# EAGLE schematic test (EAGLE 8.1.1)
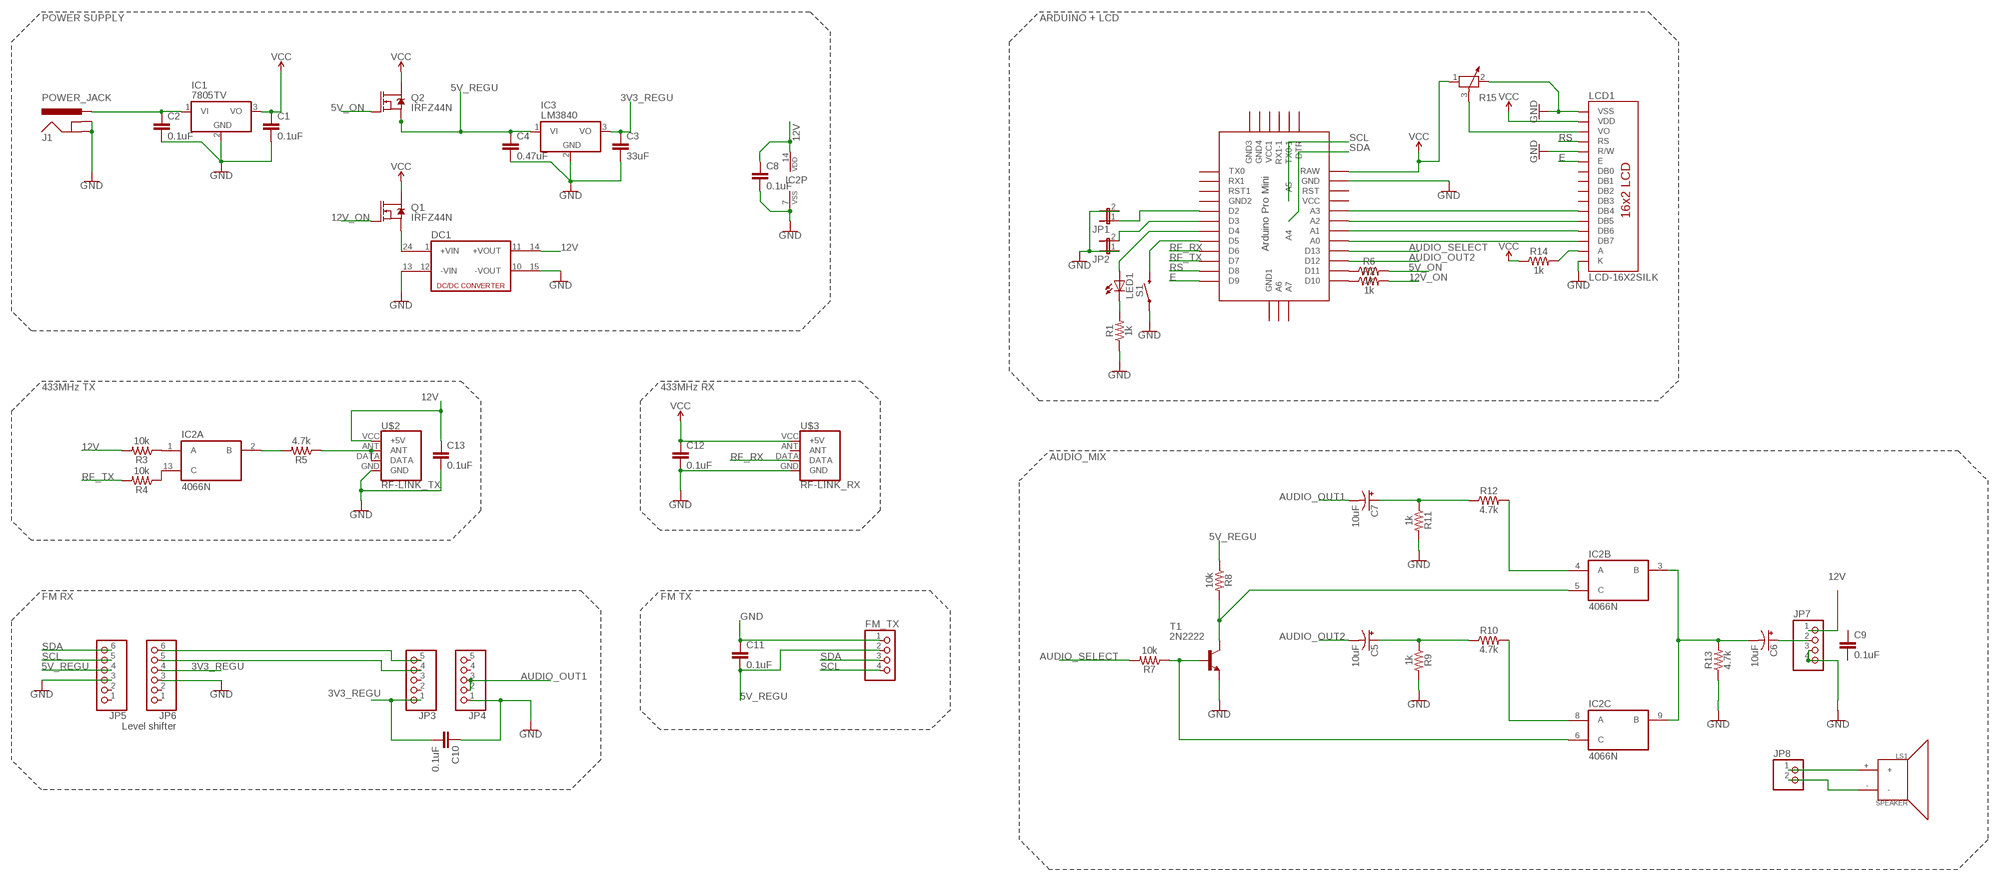
[diagram p0: schematic, sheet 1]

## Parts
C1  0.1uF  0.1UF-KIT-EZ-50V-20%  [CAP-PTH-SMALL-KIT]
C2  0.1uF  0.1UF-KIT-EZ-50V-20%  [CAP-PTH-SMALL-KIT]
C3  33uF  0.1UF-KIT-EZ-50V-20%  [CAP-PTH-SMALL-KIT]
C4  0.47uF  0.1UF-KIT-EZ-50V-20%  [CAP-PTH-SMALL-KIT]
C5  10uF  10UF-POLAR-RADIAL-2.5MM-25V-20%  [CPOL-RADIAL-2.5MM-5MM]
C6  10uF  10UF-POLAR-RADIAL-2.5MM-25V-20%  [CPOL-RADIAL-2.5MM-5MM]
C7  10uF  10UF-POLAR-RADIAL-2.5MM-25V-20%  [CPOL-RADIAL-2.5MM-5MM]
C8  0.1uF  0.1UF-KIT-EZ-50V-20%  [CAP-PTH-SMALL-KIT]
C9  0.1uF  0.1UF-KIT-EZ-50V-20%  [CAP-PTH-SMALL-KIT]
C10  0.1uF  0.1UF-KIT-EZ-50V-20%  [CAP-PTH-SMALL-KIT]
C11  0.1uF  0.1UF-KIT-EZ-50V-20%  [CAP-PTH-SMALL-KIT]
C12  0.1uF  0.1UF-KIT-EZ-50V-20%  [CAP-PTH-SMALL-KIT]
C13  0.1uF  0.1UF-KIT-EZ-50V-20%  [CAP-PTH-SMALL-KIT]
DC1  DCW1U  [DCW]
FM_TX  PINHD-1X4  [1X04]
IC1  7805TV  [TO220V]
IC2  4066N  [DIL14]
IC3  LM3840  7805TV  [TO220V]
J1  POWER_JACK  [POWER_JACK_PTH]
JP1  JUMPER-2PTH  [1X02]
JP2  JUMPER-2PTH  [1X02]
JP3  PINHD-1X5  [1X05]
JP4  PINHD-1X5  [1X05]
JP5  PINHD-1X6  [1X06]
JP6  PINHD-1X6  [1X06]
JP7  PINHD-1X4  [1X04]
JP8  PINHD-1X2  [1X02]
LCD1  LCD-16X2SILK  [LCD-16X2]
LED1  LED3MM  [LED3MM]
LS1  SPEAKER  [PCB_MOUNT_SPEAKER]
Q1  IRFZ44N  MOSFET-NCH-FQP30N06L  [TO220V]
Q2  IRFZ44N  MOSFET-NCH-FQP30N06L  [TO220V]
R1  1k  1KOHM-HORIZ-1/4W-1%  [AXIAL-0.3]
R2  1k  1KOHM-HORIZ-1/4W-1%  [AXIAL-0.3]
R3  10k  1KOHM-HORIZ-1/4W-1%  [AXIAL-0.3]
R4  10k  1KOHM-HORIZ-1/4W-1%  [AXIAL-0.3]
R5  4.7k  1KOHM-HORIZ-1/4W-1%  [AXIAL-0.3]
R6  1k  1KOHM-HORIZ-1/4W-1%  [AXIAL-0.3]
R7  10k  1KOHM-HORIZ-1/4W-1%  [AXIAL-0.3]
R8  10k  1KOHM-HORIZ-1/4W-1%  [AXIAL-0.3]
R9  1k  1KOHM-HORIZ-1/4W-1%  [AXIAL-0.3]
R10  4.7k  1KOHM-HORIZ-1/4W-1%  [AXIAL-0.3]
R11  1k  1KOHM-HORIZ-1/4W-1%  [AXIAL-0.3]
R12  4.7k  1KOHM-HORIZ-1/4W-1%  [AXIAL-0.3]
R13  4.7k  1KOHM-HORIZ-1/4W-1%  [AXIAL-0.3]
R14  1k  1KOHM-HORIZ-1/4W-1%  [AXIAL-0.3]
R15  POTENTIOMETER_PT-10  [PT-10]
S1  MOMENTARY-SWITCH-SPST-PTH-6.0MM  [TACTILE_SWITCH_PTH_6.0MM]
T1  2N2222  [TO92-EBC-OVAL]
U$1  ABK-PRO-MINI  [ABK-PRO-MINI]
U$2  RF-LINK_TX  [RF-LINK_TX]
U$3  RF-LINK_RX  RF-LINK_TX  [RF-LINK_TX]

## Nets
3V3_REGU: C3.1 C10.2 IC3.3(VO) JP3.1 JP6.4
5V_ON: Q2.1(G) R6.P$2
5V_REGU: C4.1 C11.2 FM_TX.2 IC3.1(VI) JP5.4 Q2.3(S) R8.P$1
12V: C8.1 C13.1 DC1.14(+VOUT1) IC2.14(P:VDD) JP7.1 R3.P$2 U$2.VCC(+5V)
12V_ON: Q1.1(G) R2.P$2
AUDIO_OUT1: C7.2(-) JP4.2 JP4.3
AUDIO_OUT2: C5.2(-) U$1.D12
AUDIO_SELECT: IC2.6(C:C) R7.P$1 R7.P$2 T1.B U$1.D13
E: LCD1.6(E) U$1.D9
GND: C1.2 C2.2 C3.2 C4.2 C8.2 C10.1 C11.1 C12.2 C13.2 DC1.13(-VIN1) DC1.15(-VOUT1) FM_TX.1 IC1.2(GND) IC2.7(P:VSS) IC3.2(GND) J1.GND J1.GNDBREAK JP1.2 JP2.1 JP4.1 JP5.3 JP6.3 LCD1.5(R/W) LCD1.16(K) R1.P$1 R9.P$2 R11.P$2 S1.1 T1.E U$1.GND U$2.GND U$3.GND
N$1: LED1.K(C) R1.P$2
N$2: JP1.1 U$1.D2
N$3: JP2.2 U$1.D3
N$4: LED1.A U$1.D4
N$5: R2.P$1 U$1.D10
N$6: C2.1 IC1.1(VI) J1.PWR
N$7: DC1.24(+VIN1) Q1.3(S)
N$8: IC2.13(A:C) R4.P$1
N$9: IC2.2(A:B) R5.P$2
N$10: R5.P$1 U$2.ANT U$2.DATA
N$11: JP3.5 JP6.6
N$12: JP3.4 JP6.5
N$13: R6.P$1 U$1.D11
N$14: IC2.8(C:A) R10.P$2
N$15: C5.1(+) R9.P$1 R10.P$1
N$16: IC2.5(B:C) R8.P$2 T1.C
N$17: IC2.4(B:A) R12.P$2
N$18: C7.1(+) R11.P$1 R12.P$1
N$19: JP8.1 LS1.+
N$20: JP7.3 JP7.4
N$21: C6.2(-) IC2.3(B:B) IC2.9(C:B) R13.P$2
N$22: C6.1(+) JP7.2
N$23: R13.P$1
N$24: JP8.2 LS1.-
N$25: IC2.1(A:A) R3.P$1
N$26: S1.3 U$1.D5
N$27: LCD1.14(DB7) U$1.A0
N$28: LCD1.13(DB6) U$1.A1
N$29: LCD1.12(DB5) U$1.A2
N$30: LCD1.11(DB4) U$1.A3
N$31: LCD1.2(VDD)
N$32: LCD1.1(VSS) R15.2 ; supply symbol labelled GND
N$34: LCD1.15(A) R14.P$2
N$36: LCD1.3(VO) R15.3
RF_RX: U$1.D6 U$3.DATA
RF_TX: R4.P$2 U$1.D7
RS: LCD1.4(RS) U$1.D8
SCL: FM_TX.4 JP5.5 U$1.A5
SDA: FM_TX.3 JP5.6 U$1.A4
VCC: C1.1 C12.1 IC1.3(VO) Q1.2(D) Q2.2(D) R14.P$1 R15.1 U$1.RAW U$3.VCC(+5V)
Unconnected: C9.1 C9.2 DC1.1(+VIN) DC1.10(-VOUT) DC1.11(+VOUT) DC1.12(-VIN) IC2.10(D:B) IC2.11(D:A) IC2.12(D:C) JP3.2 JP3.3 JP4.4 JP4.5 JP5.1 JP5.2 JP6.1 JP6.2 LCD1.7(DB0) LCD1.8(DB1) LCD1.9(DB2) LCD1.10(DB3) U$1.A6 U$1.A7 U$1.DTR U$1.GND1(GND2) U$1.GND2(GND3) U$1.GND3(GND4) U$1.GND4(GND1) U$1.RST U$1.RST1 U$1.RX1 U$1.RX1-1 U$1.TX0 U$1.TX0-1 U$1.VCC U$1.VCC1 U$3.ANT

## Notes on the sheet
- POWER SUPPLY | ARDUINO + LCD
- 433MHz TX | 433MHz RX
- AUDIO_MIX
- FM RX | FM TX
- Level shifter

## Library data of the parts
C1 C2 C8-C13 = SparkFun-Capacitors:0.1UF: 0.1µF ceramic capacitors A capacitor is a passive two-terminal electrical component used to store electrical energy temporarily in an electric field.; PROD_ID: CAP-08370
C3 C4 = SparkFun-Capacitors:0.1UF: 0.1µF ceramic capacitors A capacitor is a passive two-terminal electrical component used to store electrical energy temporarily in an electric field.; PROD_ID: CAP-08370; VALUE: 0.1uF
C5-C7 = SparkFun-Capacitors:10UF-POLAR: 10.0µF polarized capacitors A capacitor is a passive two-terminal electrical component used to store electrical energy temporarily in an electric field.; PROD_ID: CAP-08440
DC1 = dc-dc-converter:DCW1U: DC-DC CONVERTER; OC_FARNELL: unknown; OC_NEWARK: unknown
FM_TX JP7 = pinhead:PINHD-1X4: PIN HEADER
IC1 IC3 = linear:78*: Positive VOLTAGE REGULATOR Source: http://cache.national.com/ds/LM/LM78L05.pdf http://www.fairchildsemi.com/ds/LM/LM7805.pdf
IC2 = 40xx:4066: Quad bilateral ANALOG SWITCH
J1 = SparkFun-Connectors:POWER_JACK: Power Jack Connector This is the standard 5.5mm barrel jack for power. The PTH is the most common, proven, reliable, footprint. The Slot footprint only works if the mill layer is transmitted to the PCB fab house so be warned. Here are the connectors we sell at SparkFun: DC Barrel Power Jack/Connector <https://www.sparkfun.com/products/119> (PRT-00119) DC Barrel Power Jack/Connector (SMD) <https://www.sparkfun.com/products/12748> (PRT-12748) DC Barrel Jack Adapter - Breadboard Compatible <https://www.sparkfun.com/products/10811> (PRT-10811) It is used on this SparkFun product (and many, many others): SparkFun RedBoard - Programmed with Arduino <https://www.sparkfun.com/products/12757> (DEV-12757) Also, if you need a mating power supply or connector, please check these out: Wall Adapter Power Supply - 9VDC 650mA <https://www.sparkfun.com/products/298> (TOL-00298) DC Barrel Jack Adapter - Male <https://www.sparkfun.com/products/10287> (PRT-10287); PROD_ID: CONN-08197
JP1 JP2 = SparkFun-Retired:JUMPER-2: Jumper Basic 0.1" spaced jumper. Use with breakaway headers.
JP3 JP4 = pinhead:PINHD-1X5: PIN HEADER
JP5 JP6 = pinhead:PINHD-1X6: PIN HEADER
JP8 = pinhead:PINHD-1X2: PIN HEADER
LCD1 = SparkFun-Displays:LCD-16X2: Standard text-only 16x2 parallel input LCD Basic 16 character by 2 line display. Typically utilizes the extremely common HD44780 parallel interface chipset SparkFun Products: Basic 16x2 Green <https://www.sparkfun.com/products/255> Basic 8x2 Green <https://www.sparkfun.com/products/11122>; SF_ID: LCD-00255
LED1 = led:LED: LED OSRAM: - CHIPLED LG R971, LG N971, LY N971, LG Q971, LY Q971, LO R971, LY R971 LH N974, LH R974 LS Q976, LO Q976, LY Q976 LO Q996 - Hyper CHIPLED LW Q18S LB Q993, LB Q99A, LB R99A - SideLED LS A670, LO A670, LY A670, LG A670, LP A670 LB A673, LV A673, LT A673, LW A673 LH A674 LY A675 LS A676, LA A676, LO A676, LY A676, LW A676 LS A679, LY A679, LG A679 - Hyper Micro SIDELED® LS Y876, LA Y876, LO Y876, LY Y876 LT Y87S - SmartLED LW L88C, LW L88S LB L89C, LB L89S, LG L890 LS L89K, LO L89K, LY L89K LS L896, LA L896, LO L896, LY L896 - TOPLED LS T670, LO T670, LY T670, LG T670, LP T670 LSG T670, LSP T670, LSY T670, LOP T670, LYG T670 LG T671, LOG T671, LSG T671 LB T673, LV T673, LT T673, LW T673 LH T674 LS T676, LA T676, LO T676, LY T676, LB T676, LH T676, LSB T676, LW T676 LB T67C, LV T67C, LT T67C, LS T67K, LO T67K, LY T67K, LW E67C LS E67B, LA E67B, LO E67B, LY E67B, LB E67C, LV E67C, LT E67C LW T67C LS T679, LY T679, LG T679 LS T770, LO T770, LY T770, LG T770, LP T770 LB T773, LV T773, LT T773, LW T773 LH T774 LS E675, LA E675, LY E675, LS T675 LS T776, LA T776, LO T776, LY T776, LB T776 LHGB T686 LT T68C, LB T68C - Hyper Mini TOPLED® LB M676 - Mini TOPLED Santana® LG M470 LS M47K, LO M47K, LY M47K Source: http://www.osram.convergy.de LUXEON: - LUMILED® LXK2-PW12-R00, LXK2-PW12-S00, LXK2-PW14-U00, LXK2-PW14-V00 LXK2-PM12-R00, LXK2-PM12-S00, LXK2-PM14-U00 LXK2-PE12-Q00, LXK2-PE12-R00, LXK2-PE12-S00, LXK2-PE14-T00, LXK2-PE14-U00 LXK2-PB12-K00, LXK2-PB12-L00, LXK2-PB12-M00, LXK2-PB14-N00, LXK2-PB14-P00, LXK2-PB14-Q00 LXK2-PR12-L00, LXK2-PR12-M00, LXK2-PR14-Q00, LXK2-PR14-R00 LXK2-PD12-Q00, LXK2-PD12-R00, LXK2-PD12-S00 LXK2-PH12-R00, LXK2-PH12-S00 LXK2-PL12-P00, LXK2-PL12-Q00, LXK2-PL12-R00 Source: www.luxeon.com KINGBRIGHT: KA-3528ASYC Source: www.kingbright.com
LS1 = SparkFun-Electromechanical:SPEAKER: Speaker Generic 2-terminal loudspeakers SparkFun Products Speaker - PCB Mount <https://www.sparkfun.com/products/11089> (COM-11089); PROD_ID: COMP-11789; SF_SKU: COM-11089
Q1 Q2 = SparkFun-DiscreteSemi:MOSFET-NCH: N-channel MOSFETs Voltage controlled devices that allow control of high current outputs. SparkFun Products: SparkFun OpenScale <https://www.sparkfun.com/products/13261> SparkFun Digital Sandbox <https://www.sparkfun.com/products/12651> SparkFun Monster Moto Shield <https://www.sparkfun.com/products/10182> SparkFun MOSFET Power Controller <https://www.sparkfun.com/products/11214>; PROD_ID: TRANS-10060; VALUE: 60V/32A/35mΩ
R1 R2 R6 R9 R11 R14 = SparkFun-Resistors:1KOHM: 1kΩ resistor A resistor is a passive two-terminal electrical component that implements electrical resistance as a circuit element. Resistors act to reduce current flow, and, at the same time, act to lower voltage levels within circuits. - Wikipedia; PROD_ID: RES-12182
R3-R5 R7 R8 R10 R12 R13 = SparkFun-Resistors:1KOHM: 1kΩ resistor A resistor is a passive two-terminal electrical component that implements electrical resistance as a circuit element. Resistors act to reduce current flow, and, at the same time, act to lower voltage levels within circuits. - Wikipedia; PROD_ID: RES-12182; VALUE: 1k
R15 = rcl:POTENTIOMETER_: Potentiometer
S1 = SparkFun-Switches:MOMENTARY-SWITCH-SPST: Momentary Switch (Pushbutton) - SPST Normally-open (NO) SPST momentary switches (buttons, pushbuttons). Variants PTH-12MM - 12mm square, through-hole Momentary Pushbutton Switch - 12mm Square <https://www.sparkfun.com/products/9190> (COM-09190) PTH-6.0MM, PTH-6.0MM-KIT - 6.0mm square, through-hole Mini Pushbutton Switch <https://www.sparkfun.com/products/97> (COM-00097) KIT package intended for soldering kit's - only one side of pads' copper is exposed. PTH-RIGHT-ANGLE-KIT - Right-angle, through-hole Right Angle Tactile Button <https://www.sparkfun.com/products/10791> - Used on SparkFun BigTime Watch Kit <https://www.sparkfun.com/products/11734> SMD-12MM - 12mm square, surface-mount Tactile Button - SMD (12mm) <https://www.sparkfun.com/products/12993> (COM-12993) Used on SparkFun PicoBoard <https://www.sparkfun.com/products/11888> SMD-4.5MM - 4.5mm Square Trackball Switch Used on SparkFun Blackberry Trackballer Breakout <https://www.sparkfun.com/products/13169> SMD-4.6MMX2.8MM - 4.60mm x 2.80mm, surface mount Used on SparkFun SAMD21 Mini Breakout <https://www.sparkfun.com/products/13664> SMD-5.2MM, SMD-5.2-REDUNDANT - 5.2mm square, surface-mount Mini Pushbutton Switch - SMD <https://www.sparkfun.com/products/8720> (COM-08720) Used on Arduino Pro Mini <https://www.sparkfun.com/products/11114> REDUNDANT package connects both switch circuits together SMD-6.0X3.5MM - 6.0 x 3.5mm, surface mount Momentary Reset Switch SMD <https://www.sparkfun.com/products/8229> (COM-08229) SMD-6.2MM-TALL - 6.2mm square, surface mount Tactile Button - SMD (6mm) <https://www.sparkfun.com/products/12992> Used on SparkFun Digital Sandbox <https://www.sparkfun.com/products/12651> SMD-RIGHT-ANGLE - Right-angle, surface mount Used on SparkFun Block for Intel® Edison - Arduino <https://www.sparkfun.com/products/13036>; PROD_ID: SWCH-08441; SF_SKU: COM-00097
T1 = adafruit:2N2222: NPN TRANSISTOR Big oval pads
U$1 = Arduino-clone:ABK-PRO-MINI: ABK Pro-Mini Arduino Clone
U$2 U$3 = SparkFun-RF:RF-LINK_TX: RF Link Transmitter (434 MHz, 315 MHz) These wireless transmitters work with equivalent receivers. They can easily fit into a breadboard and work well with microcontrollers to create a very simple wireless data link. Since these are only transmitters, they will only work communicating data one-way, you would need two pairs (of different frequencies) to act as a transmitter/receiver pair. SparkFun Products RF Link Transmitter - 434MHz <https://www.sparkfun.com/products/10534> (WRL-10534); SF_ID: WRL-10534